# Altium schematic sheet 原理图.SchDoc
size A4
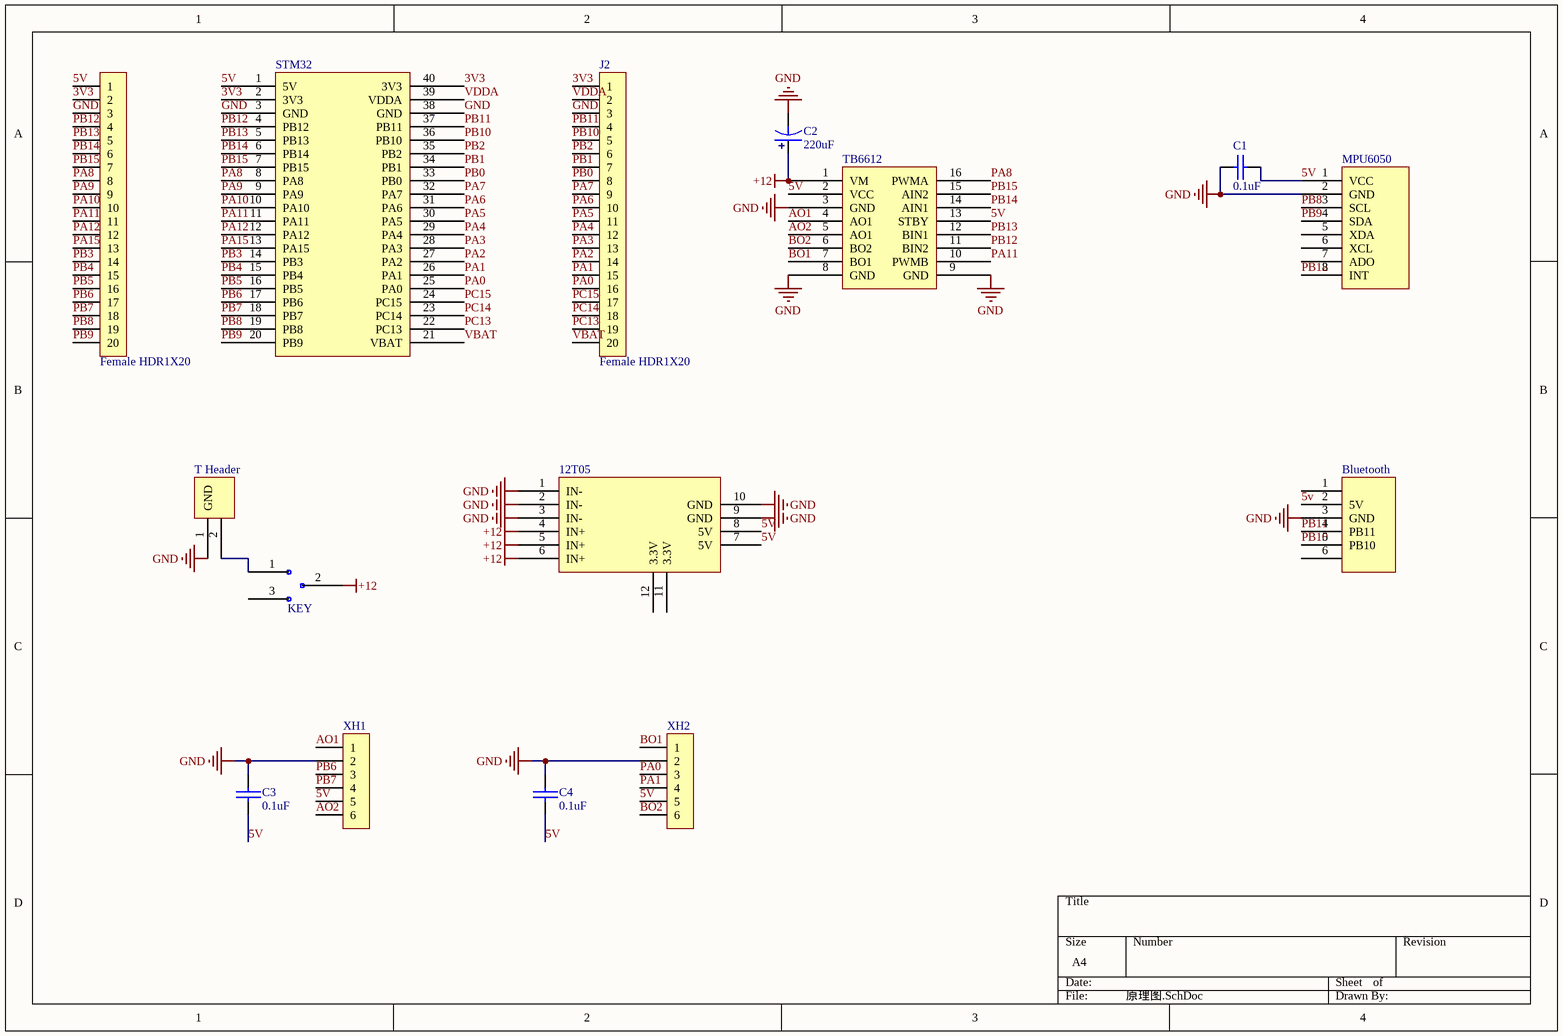
[diagram p0: 原理图.SchDoc]

## Parts
12T05  稳压12T05 T03.3  [稳压12T05 T03.3]  (value not drawn)
*  KEY  [SS12d11拨动电源开关]
Bluetooth  蓝牙  [1*6弯排母]  (value not drawn)
C1  0.1uF  [RAD-0.2]
C2  220uF  [DIP-EC8X12]
C3  0.1uF  [RAD-0.2]
C4  0.1uF  [RAD-0.2]
J1  Female HDR1X20  [Fe-HDR1X20/2.54-S]
J2  Female HDR1X20  [Fe-HDR1X20/2.54-S]
MPU6050  MPU6050  [MPU6050]  (value not drawn)
STM32  STM32  [stm32]  (value not drawn)
T_Header  T型接头  [T HEAD]  (value not drawn)
TB6612  TB6612  [TB6612]  (value not drawn)
XH1  (no value)  [XH6/2.54mm/90]
XH2  (no value)  [XH6/2.54mm/90]

## Nets
+12: 12T05.4(IN+) 12T05.5(IN+) 12T05.6(IN+) *.2 C2.1 TB6612.1(VM)
GND: 12T05.1(IN-) 12T05.2(IN-) 12T05.3(IN-) 12T05.9(GND) 12T05.10(GND) Bluetooth.3(GND) C1.2 C2.2 C3.2 C4.2 J1.3 J2.3 MPU6050.2(GND) STM32.3(GND) STM32.38(GND) T_Header.1(GND) TB6612.3(GND) TB6612.8(GND) TB6612.9(GND) XH1.2 XH2.2
3V3: J1.2 J2.1 STM32.2(3V3) STM32.40(3V3)
5V: 12T05.7(5V) 12T05.8(5V) Bluetooth.2(5V) C1.1 C3.1 C4.1 J1.1 MPU6050.1(VCC) STM32.1(5V) TB6612.2(VCC) TB6612.13(STBY) XH1.5 XH2.5
AO1: TB6612.4(AO1) XH1.1
AO2: TB6612.5(AO1) XH1.6
BO1: TB6612.7(BO1) XH2.1
BO2: TB6612.6(BO2) XH2.6
PA0: J2.16 STM32.25(PA0) XH2.3
PA1: J2.15 STM32.26(PA1) XH2.4
PA2: J2.14 STM32.27(PA2)
PA3: J2.13 STM32.28(PA3)
PA4: J2.12 STM32.29(PA4)
PA5: J2.11 STM32.30(PA5)
PA6: J2.10 STM32.31(PA6)
PA7: J2.9 STM32.32(PA7)
PA8: J1.8 STM32.8(PA8) TB6612.16(PWMA)
PA9: J1.9 STM32.9(PA9)
PA10: J1.10 STM32.10(PA10)
PA11: J1.11 STM32.11(PA11) TB6612.10(PWMB)
PA12: J1.12 STM32.12(PA12)
PA15: J1.13 STM32.13(PA15)
PB0: J2.8 STM32.33(PB0)
PB1: J2.7 STM32.34(PB1)
PB2: J2.6 STM32.35(PB2)
PB3: J1.14 STM32.14(PB3)
PB4: J1.15 STM32.15(PB4)
PB5: J1.16 STM32.16(PB5)
PB6: J1.17 STM32.17(PB6) XH1.3
PB7: J1.18 STM32.18(PB7) XH1.4
PB8: J1.19 MPU6050.3(SCL) STM32.19(PB8)
PB9: J1.20 MPU6050.4(SDA) STM32.20(PB9)
PB10: Bluetooth.5(PB10) J2.5 STM32.36(PB10)
PB11: Bluetooth.4(PB11) J2.4 STM32.37(PB11)
PB12: J1.4 MPU6050.8(INT) STM32.4(PB12) TB6612.11(BIN2)
PB13: J1.5 STM32.5(PB13) TB6612.12(BIN1)
PB14: J1.6 STM32.6(PB14) TB6612.14(AIN1)
PB15: J1.7 STM32.7(PB15) TB6612.15(AIN2)
PC13: J2.19 STM32.22(PC13)
PC14: J2.18 STM32.23(PC14)
PC15: J2.17 STM32.24(PC15)
VBAT: J2.20 STM32.21(VBAT)
VDDA: J2.2 STM32.39(VDDA)
Net*_1: *.1 T_Header.2

Not connected (* = marked no-connect by the designer): 12T05 11(3.3V) 12(3.3V); * 3; Bluetooth 1 6; MPU6050 5(XDA) 6(XCL) 7(ADO)

## Library data of the parts
C1 C3 C4 = CAP: 无极性电容
C2 = DIP_ECAP: 直插电解电容
XH1 XH2 = XH6